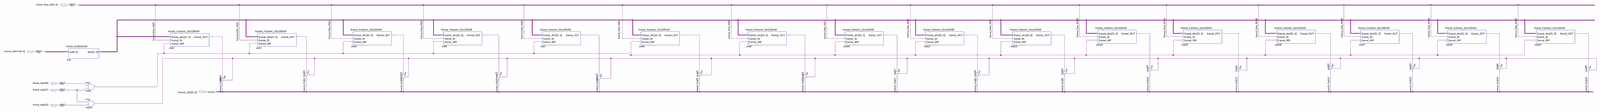
[diagram p0: schematic sheet, whole]
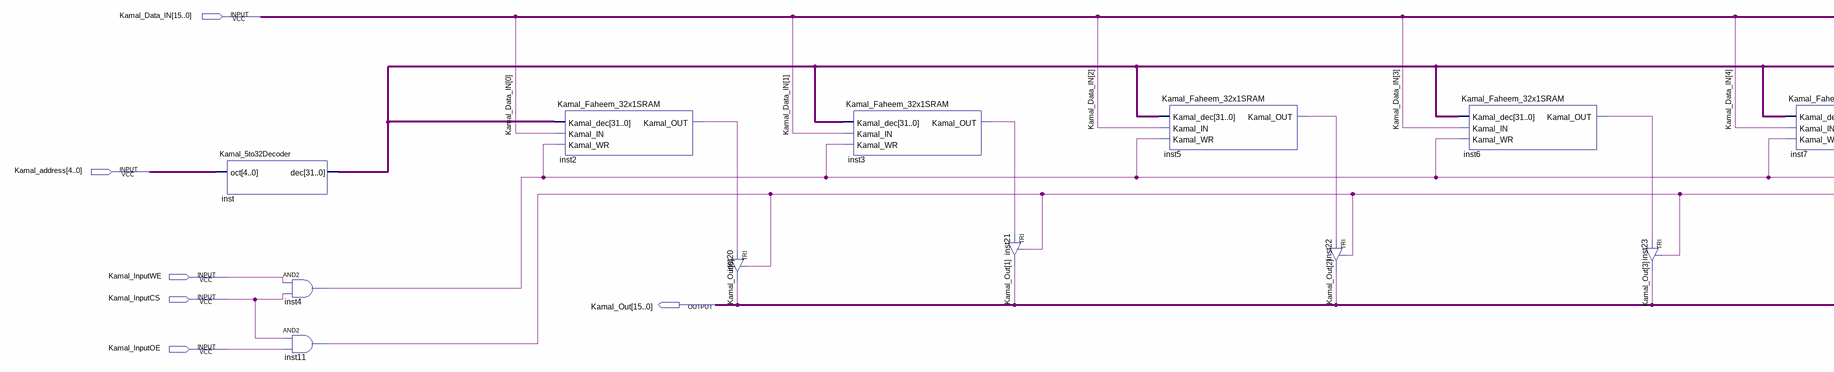
[diagram p1: schematic sheet, left part]
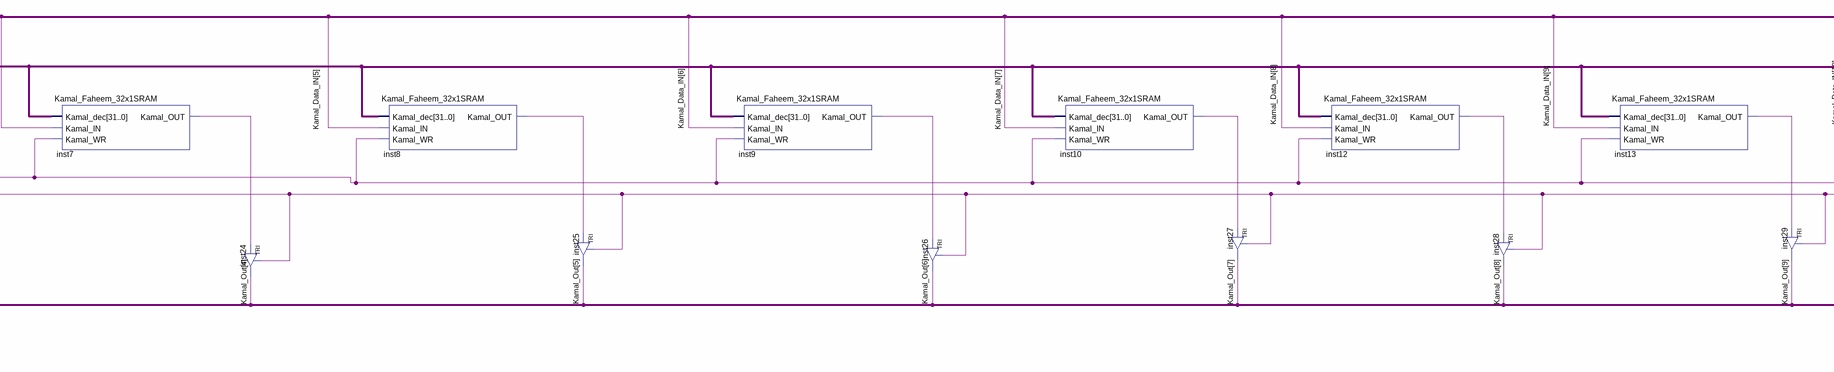
[diagram p2: schematic sheet, centre part]
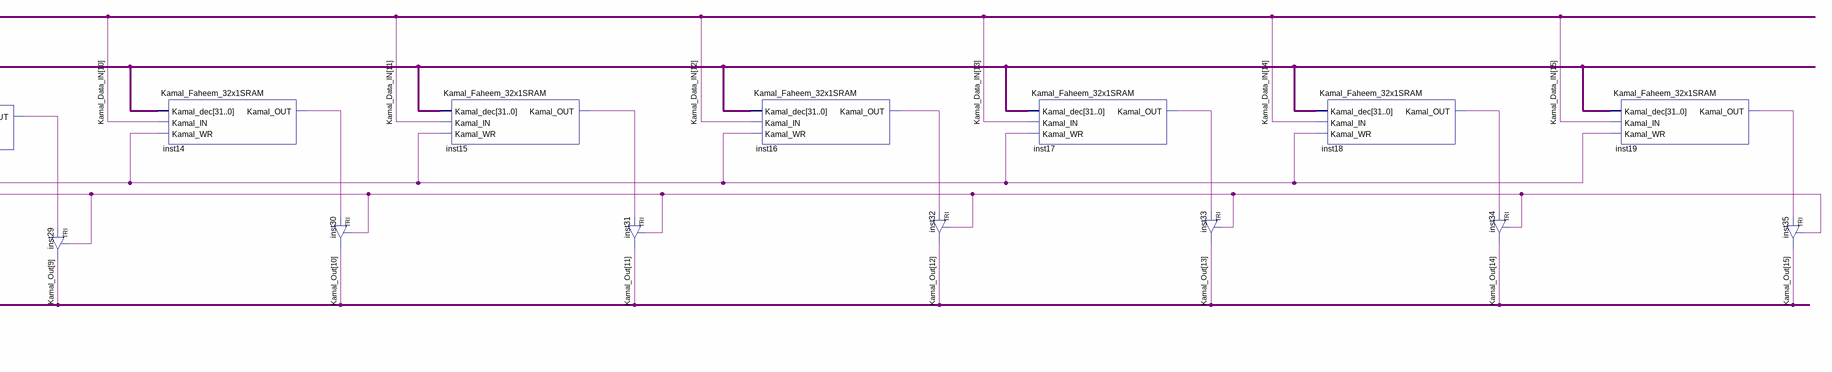
[diagram p3: schematic sheet, right part]
// Quartus schematic Kamal_Faheem_16x32SRAM.bdf as structural Verilog: 35 symbols, 6 pins
module Kamal_Faheem_16x32SRAM (
  input  [15:0] Kamal_Data_IN,
  input  [4:0] Kamal_address,
  input  Kamal_InputWE,
  input  Kamal_InputCS,
  input  Kamal_InputOE,
  output [15:0] Kamal_Out
);

  wire inst2_kamal_out, inst3_kamal_out, inst4_out, inst5_kamal_out, inst6_kamal_out, inst7_kamal_out,
       inst8_kamal_out, inst9_kamal_out, inst10_kamal_out, inst11_out, inst12_kamal_out, inst13_kamal_out,
       inst14_kamal_out, inst15_kamal_out, inst16_kamal_out, inst17_kamal_out, inst18_kamal_out,
       inst19_kamal_out;
  wire [31:0] inst_dec;

  Kamal_5to32Decoder inst (.oct(Kamal_address), .dec(inst_dec));
  and inst4 (inst4_out, Kamal_InputWE, Kamal_InputCS);
  and inst11 (inst11_out, Kamal_InputCS, Kamal_InputOE);
  Kamal_Faheem_32x1SRAM inst2 (
    .Kamal_dec(inst_dec), .Kamal_IN(Kamal_Data_IN[0]), .Kamal_WR(inst4_out), .Kamal_OUT(inst2_kamal_out));
  TRI inst20 (.IN(inst2_kamal_out), .OE(inst11_out), .OUT(Kamal_Out[0]));
  Kamal_Faheem_32x1SRAM inst3 (
    .Kamal_dec(inst_dec), .Kamal_IN(Kamal_Data_IN[1]), .Kamal_WR(inst4_out), .Kamal_OUT(inst3_kamal_out));
  TRI inst21 (.IN(inst3_kamal_out), .OE(inst11_out), .OUT(Kamal_Out[1]));
  Kamal_Faheem_32x1SRAM inst5 (
    .Kamal_dec(inst_dec), .Kamal_IN(Kamal_Data_IN[2]), .Kamal_WR(inst4_out), .Kamal_OUT(inst5_kamal_out));
  TRI inst22 (.IN(inst5_kamal_out), .OE(inst11_out), .OUT(Kamal_Out[2]));
  Kamal_Faheem_32x1SRAM inst6 (
    .Kamal_dec(inst_dec), .Kamal_IN(Kamal_Data_IN[3]), .Kamal_WR(inst4_out), .Kamal_OUT(inst6_kamal_out));
  TRI inst23 (.IN(inst6_kamal_out), .OE(inst11_out), .OUT(Kamal_Out[3]));
  Kamal_Faheem_32x1SRAM inst7 (
    .Kamal_dec(inst_dec), .Kamal_IN(Kamal_Data_IN[4]), .Kamal_WR(inst4_out), .Kamal_OUT(inst7_kamal_out));
  TRI inst24 (.IN(inst7_kamal_out), .OE(inst11_out), .OUT(Kamal_Out[4]));
  Kamal_Faheem_32x1SRAM inst8 (
    .Kamal_dec(inst_dec), .Kamal_IN(Kamal_Data_IN[5]), .Kamal_WR(inst4_out), .Kamal_OUT(inst8_kamal_out));
  TRI inst25 (.IN(inst8_kamal_out), .OE(inst11_out), .OUT(Kamal_Out[5]));
  Kamal_Faheem_32x1SRAM inst9 (
    .Kamal_dec(inst_dec), .Kamal_IN(Kamal_Data_IN[6]), .Kamal_WR(inst4_out), .Kamal_OUT(inst9_kamal_out));
  TRI inst26 (.IN(inst9_kamal_out), .OE(inst11_out), .OUT(Kamal_Out[6]));
  Kamal_Faheem_32x1SRAM inst10 (
    .Kamal_dec(inst_dec), .Kamal_IN(Kamal_Data_IN[7]), .Kamal_WR(inst4_out), .Kamal_OUT(inst10_kamal_out));
  TRI inst27 (.IN(inst10_kamal_out), .OE(inst11_out), .OUT(Kamal_Out[7]));
  Kamal_Faheem_32x1SRAM inst12 (
    .Kamal_dec(inst_dec), .Kamal_IN(Kamal_Data_IN[8]), .Kamal_WR(inst4_out), .Kamal_OUT(inst12_kamal_out));
  TRI inst28 (.IN(inst12_kamal_out), .OE(inst11_out), .OUT(Kamal_Out[8]));
  Kamal_Faheem_32x1SRAM inst13 (
    .Kamal_dec(inst_dec), .Kamal_IN(Kamal_Data_IN[9]), .Kamal_WR(inst4_out), .Kamal_OUT(inst13_kamal_out));
  TRI inst29 (.IN(inst13_kamal_out), .OE(inst11_out), .OUT(Kamal_Out[9]));
  Kamal_Faheem_32x1SRAM inst14 (
    .Kamal_dec(inst_dec), .Kamal_IN(Kamal_Data_IN[10]), .Kamal_WR(inst4_out), .Kamal_OUT(inst14_kamal_out));
  TRI inst30 (.IN(inst14_kamal_out), .OE(inst11_out), .OUT(Kamal_Out[10]));
  Kamal_Faheem_32x1SRAM inst15 (
    .Kamal_dec(inst_dec), .Kamal_IN(Kamal_Data_IN[11]), .Kamal_WR(inst4_out), .Kamal_OUT(inst15_kamal_out));
  TRI inst31 (.IN(inst15_kamal_out), .OE(inst11_out), .OUT(Kamal_Out[11]));
  Kamal_Faheem_32x1SRAM inst16 (
    .Kamal_dec(inst_dec), .Kamal_IN(Kamal_Data_IN[12]), .Kamal_WR(inst4_out), .Kamal_OUT(inst16_kamal_out));
  TRI inst32 (.IN(inst16_kamal_out), .OE(inst11_out), .OUT(Kamal_Out[12]));
  Kamal_Faheem_32x1SRAM inst17 (
    .Kamal_dec(inst_dec), .Kamal_IN(Kamal_Data_IN[13]), .Kamal_WR(inst4_out), .Kamal_OUT(inst17_kamal_out));
  TRI inst33 (.IN(inst17_kamal_out), .OE(inst11_out), .OUT(Kamal_Out[13]));
  Kamal_Faheem_32x1SRAM inst18 (
    .Kamal_dec(inst_dec), .Kamal_IN(Kamal_Data_IN[14]), .Kamal_WR(inst4_out), .Kamal_OUT(inst18_kamal_out));
  TRI inst34 (.IN(inst18_kamal_out), .OE(inst11_out), .OUT(Kamal_Out[14]));
  Kamal_Faheem_32x1SRAM inst19 (
    .Kamal_dec(inst_dec), .Kamal_IN(Kamal_Data_IN[15]), .Kamal_WR(inst4_out), .Kamal_OUT(inst19_kamal_out));
  TRI inst35 (.IN(inst19_kamal_out), .OE(inst11_out), .OUT(Kamal_Out[15]));
endmodule
